# EAGLE design RFM69_NRF_adapter (EAGLE 8.3.2)
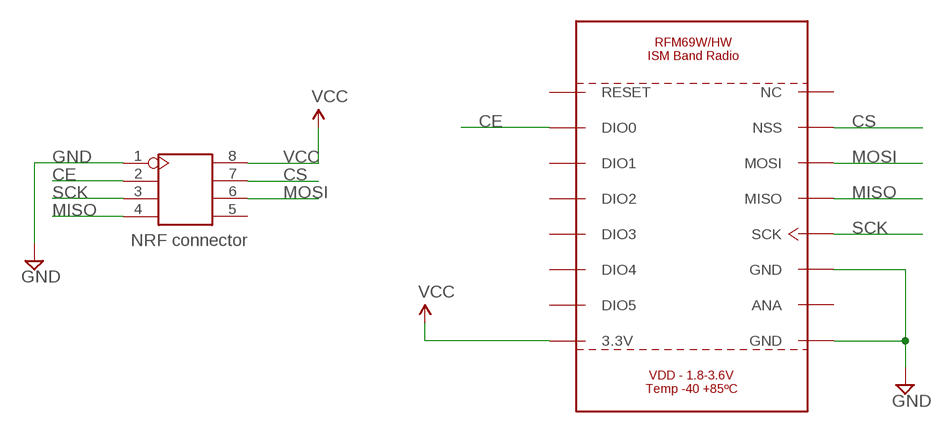
[diagram p0: schematic, sheet 1]

## Parts
J1  NRF connector  HEADER-2X4P-2.54  [2X4P-2.54]
U$1  RFM69W/HW-  [RFM69W/HW]

## Nets
CE: J1.2 U$1.P$2(DIO0)
CS: J1.7 U$1.P$15(NSS)
GND: J1.1 U$1.P$9(GND) U$1.P$11(GND)
MISO: J1.4 U$1.P$13(MISO)
MOSI: J1.6 U$1.P$14(MOSI)
SCK: J1.3 U$1.P$12(SCK)
VCC: J1.8 U$1.P$8(3.3V)
Unconnected: J1.5 U$1.P$1(RESET) U$1.P$3(DIO1) U$1.P$4(DIO2) U$1.P$5(DIO3) U$1.P$6(DIO4) U$1.P$7(DIO5) U$1.P$10(ANA) U$1.P$16(NC)

## Library data of the parts
J1 = Seeed-Connector:HEADER-2X4P
U$1 = HopeRF:RFM69W/HW: HopeRF RFM69W / RFM69HW ISM Band Radio Modules The RFM69W/HW are transceiver modules capable of operation over a wide frequency range, including the 315, 433, 868 and 915MHz license-free ISM (Industry Scientific and Medical) frequency bands. All major RF communication parameters are programmable and most of them can be dynamically set. The RFM69W/HW offer the unique advantage of programmable narrow-band and wide- band communication modes The RFM69W/HW are optimized for low power consumption while offering high RF output power and channelized operation. Compliance ETSI and FCC regulations. Features +13 dBm (+20 dBm - 100 mW for HW variant) Power Output Capability High Sensitivity: down to -120 dBm at 1.2 kbps High Selectivity: 16-tap FIR Channel Filter Bullet-proof front end: IIP3 = -18 dBm, IIP2 = +35 dBm,80 dB Blocking Immunity, no Image Frequency response Low current: Rx = 16 mA, 100nA register retention Programmable Pout: -18 to +13 dBm (+20 dBm for the HW variant) in 1dB steps Constant RF performance over voltage range of module FSK Bit rates up to 300 kb/s Fully integrated synthesizer with a resolution of 61 Hz FSK, GFSK, MSK, GMSK and OOK modulations Built-in Bit Synchronizer performing Clock Recovery Incoming Sync Word Recognition 115 dB+ Dynamic Range RSSI Automatic RF Sense with ultra-fast AFC Packet engine with CRC-16, AES-128, 66-byte FIFO Built-in temperature sensor Module Size:19.7X16mm Purchase at: Anarduino.com <http://www.anarduino.com/?cid=1> RS Components <http://au.rs-online.com/web/c/computing-peripherals/wireless-components-modules/telemetry-modules/?searchTerm=RFM69W&h=s&sra=oss&redirect-relevancy-data=636F3D3226696E3D4931384E4B6E6F776E41734D504E266C753D656E266D6D3D6D61746368616C6C7061727469616C26706D3D5E5B5C707B4C7D5C707B4E647D2D2C2F255C2E5D2B2426706F3D313326736E3D592673743D4D414E5F504152545F4E554D4245522677633D424F5448267573743D52464D363957267374613D52464D36395726>

## Net classes
1 power: width 0.203 mm, drill 0.305 mm, clearance 0.152 mm

## Board
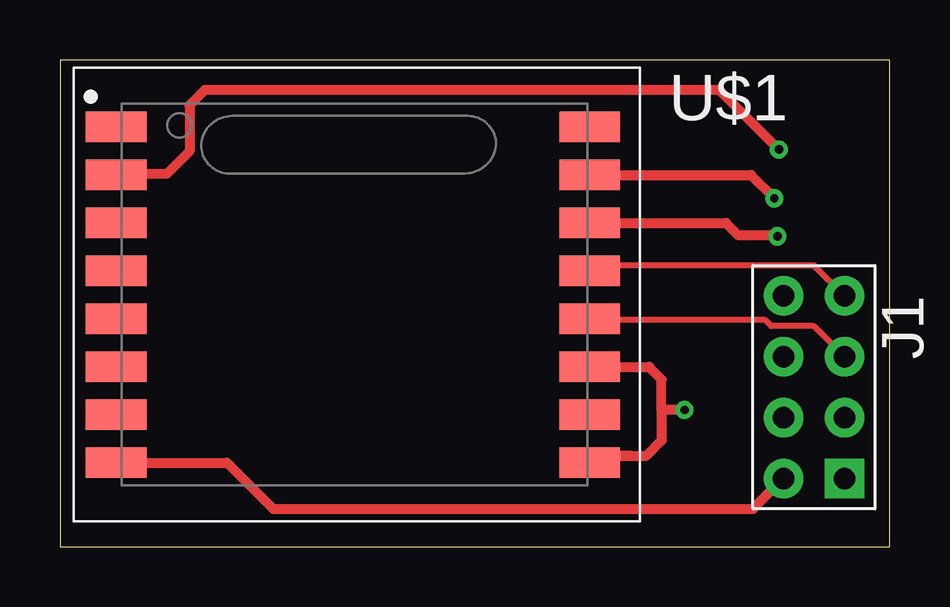
[diagram p1: board, top side]
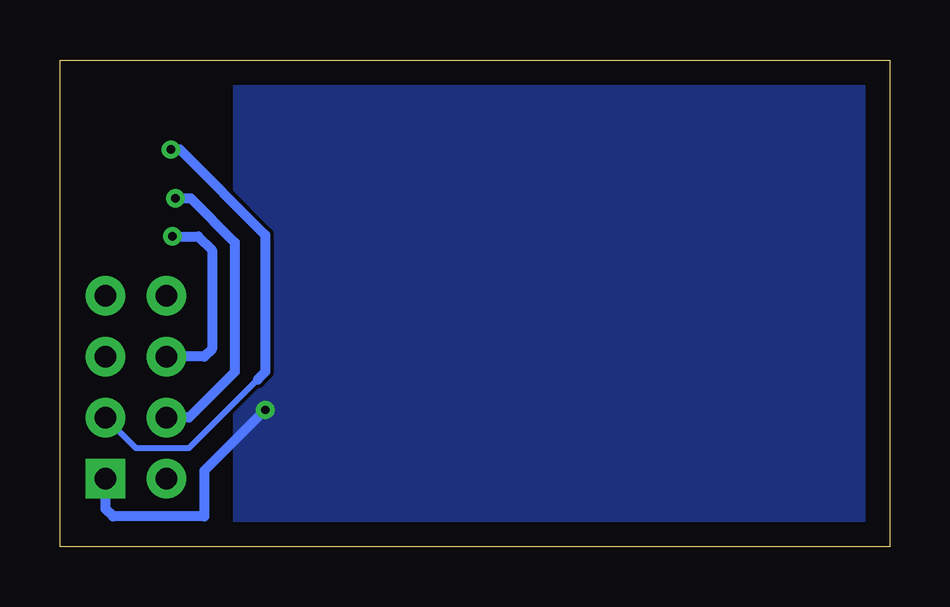
[diagram p2: board, bottom side, seen from below]

Size 34.59 x 20.31 mm. Coordinates in mm from the lower left corner, seen from the top.
Outline: 0,0 34.59,0 34.59,20.31 0,20.31 0,0
Copper layers (1*16): Top 0.035mm / dielectric 1.5mm / Bottom 0.035mm
Design rules "default": minimum track width 6mil, minimum drill 0.35mm, track to track 6mil, track to pad 6mil, pad to pad 6mil, via to via 6mil, smd to smd 6mil, copper to edge 40mil, drill to drill 6mil, minimum pad ring 10mil, minimum via ring 8mil, stop-mask expansion 4mil, vias tented up to drill 0mil, thermal gap 10mil

### Footprints (pad centres in the part's own frame; a part is rotated, then mirrored left to right if it is on the bottom)
2X4P-2.54 = drill 0.889 pad 1.651 square: 1 -1.27,3.81 | drill 0.889 pad 1.651: 2 -1.27,1.27; 3 -1.27,-1.27; 4 -1.27,-3.81; 5 1.27,-3.81; 6 1.27,-1.27; 7 1.27,1.27; 8 1.27,3.81
RFM69W/HW = smd 2.54 x 1.27: P$1 -10.03,7.035; P$2 -10.03,5.035; P$3 -10.03,3.035; P$4 -10.03,1.035; P$5 -10.03,-0.965; P$6 -10.03,-2.965; P$7 -10.03,-4.965; P$8 -10.03,-6.965; P$9 9.7,-6.965; P$10 9.7,-4.965; P$11 9.7,-2.965; P$12 9.7,-0.965; P$13 9.7,1.035; P$14 9.7,3.035; P$15 9.7,5.035; P$16 9.7,7.035

### Placement (x,y rotation side)
J1  31.43,6.67 180 top
U$1  12.38,10.48 0 top

### Tracks (layer width: path | path; a pad name or v marks a point on that pad's centre or on a via)
CE  (via drill 0.35)
  Top 0.254: U$1.P$2 2.48,15.3
  Top 0.406: v29.97,16.57 27.5,19.05 6.03,19.05 5.4,18.41 5.4,16.51 4.44,15.56 2.4,15.56 U$1.P$2
  Bottom 0.254: J1.2 31.43,4.13 29.21,4.13 26.35,6.99
  Bottom 0.406: v29.97,16.57 29.59,16.57 26.04,13.02 26.04,7.3 26.35,6.99
CS  (via drill 0.35)
  Top 0.254: 21.02,15.3 22.03,15.3 U$1.P$15
  Top 0.406: U$1.P$15 28.81,15.51 v29.78,14.54
  Bottom 0.406: v29.78,14.54 29.15,14.54 27.31,12.7 27.31,7.3 29.21,5.4 J1.7
GND  (via drill 0.35)
  Top 0.406: U$1.P$11 24.56,7.51 25.08,6.99 25.08,5.72 | 25.08,5.72 25.08,4.44 24.45,3.81 23.81,3.81 | 23.81,3.81 23.18,3.81 | v26.04,5.72 25.08,5.72 | U$1.P$9 22.38,3.81 23.81,3.81
  Bottom 0.406: v26.04,5.72 28.57,3.18 28.57,1.27 32.38,1.27 32.7,1.59 J1.1
  pour Bottom: 0.32,20 0.32,0.32 26.99,0.32 27.3,0.63 27.3,19.68 26.99,20
MISO
  Top 0.254: J1.4 31.43,11.75 22.29,11.75 U$1.P$13
MOSI  (via drill 0.35)
  Top 0.254: 22.29,13.27 U$1.P$14
  Top 0.406: U$1.P$14 27.76,13.51 28.26,13.02 29.84,13.02 v29.91,12.95
  Bottom 0.406: v29.91,12.95 28.83,12.95 28.26,12.38 28.26,8.25 28.57,7.94 J1.6
SCK
  Top 0.254: J1.3 31.43,9.21 29.65,9.21 29.4,9.46 22.29,9.46 U$1.P$12
VCC
  Top 0.406: U$1.P$8 6.97,3.51 8.89,1.59 28.89,1.59 J1.8